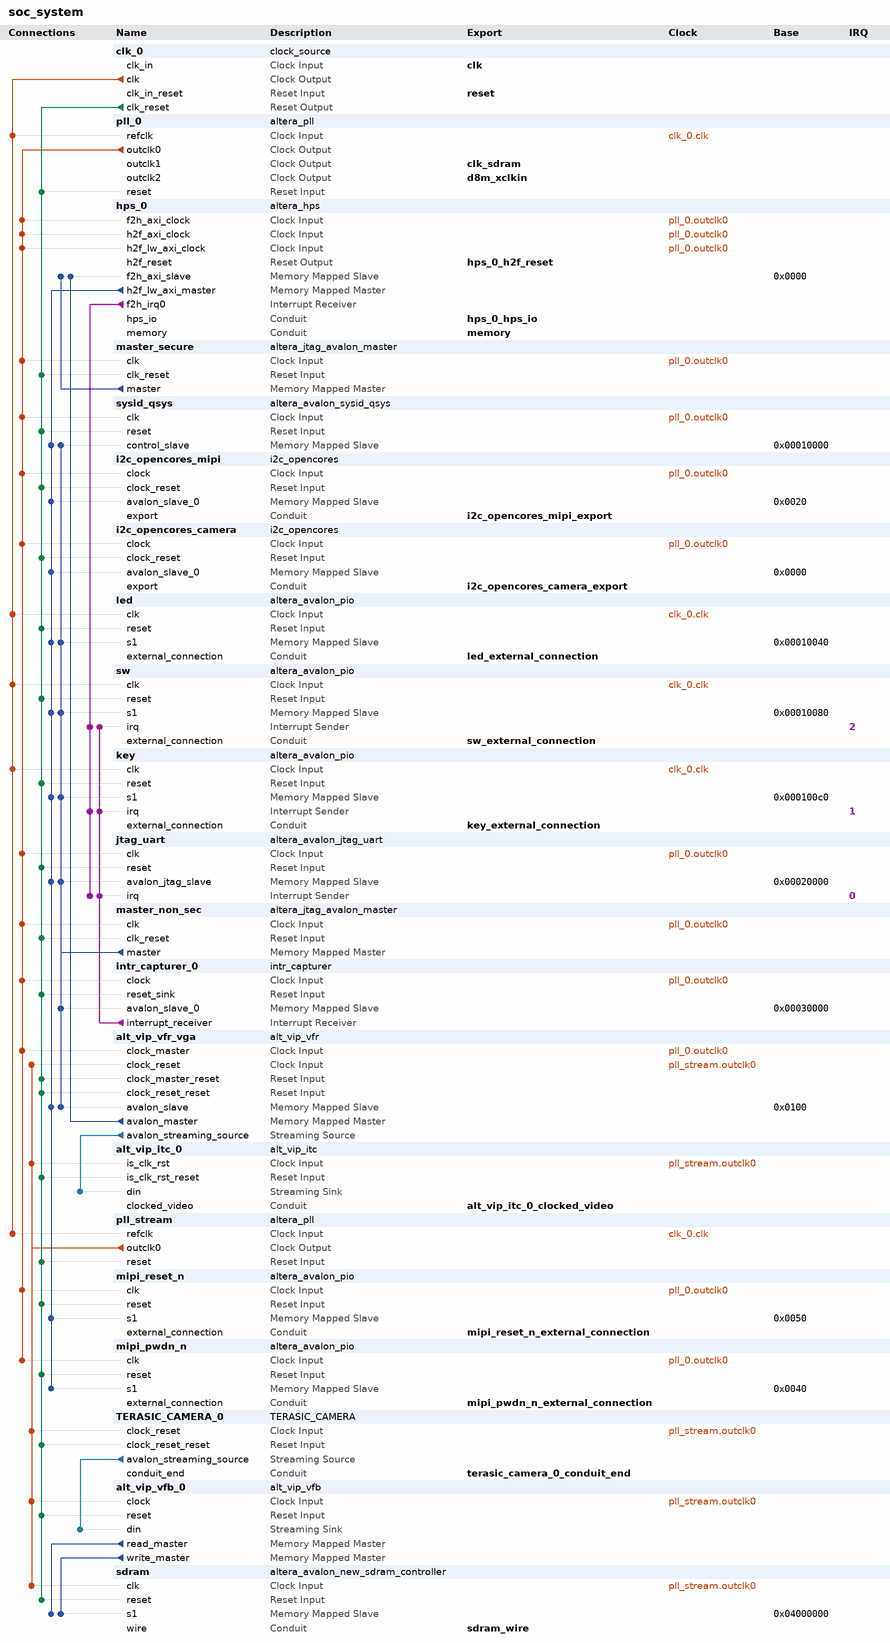
[diagram p0: system contents]
# Platform Designer (Qsys) system soc_system, Cyclone V 5CSEMA5F31C6
# Parameters at their usual value, and those the tool derives, are not listed.
package require -exact qsys 15.1
create_system soc_system
set_project_property DEVICE_FAMILY {Cyclone V}
set_project_property DEVICE 5CSEMA5F31C6

add_instance clk_0 clock_source 15.1
set_instance_parameter_value clk_0 clockFrequency 50000000

add_instance pll_0 altera_pll 15.1
set_instance_parameter_value pll_0 gui_device_speed_grade 1
set_instance_parameter_value pll_0 gui_number_of_clocks 3
set_instance_parameter_value pll_0 gui_operation_mode direct
set_instance_parameter_value pll_0 gui_output_clock_frequency0 100.0
set_instance_parameter_value pll_0 gui_output_clock_frequency1 100.0
set_instance_parameter_value pll_0 gui_output_clock_frequency2 20.0
set_instance_parameter_value pll_0 gui_phase_shift1 -4000
set_instance_parameter_value pll_0 gui_pll_mode {Integer-N PLL}
set_instance_parameter_value pll_0 gui_reference_clock_frequency 100.0
set_instance_parameter_value pll_0 gui_use_locked false

add_instance hps_0 altera_hps 15.1
set_instance_parameter_value hps_0 BOOTFROMFPGA_Enable true
set_instance_parameter_value hps_0 EMAC1_Mode RGMII
set_instance_parameter_value hps_0 EMAC1_PinMuxing {HPS I/O Set 0}
set_instance_parameter_value hps_0 F2SCLK_COLDRST_Enable false
set_instance_parameter_value hps_0 F2SCLK_DBGRST_Enable false
set_instance_parameter_value hps_0 F2SCLK_WARMRST_Enable false
set_instance_parameter_value hps_0 F2SINTERRUPT_Enable true
set_instance_parameter_value hps_0 F2S_Width 3
set_instance_parameter_value hps_0 FPGA_PERIPHERAL_OUTPUT_CLOCK_FREQ_EMAC0_GTX_CLK 100
set_instance_parameter_value hps_0 FPGA_PERIPHERAL_OUTPUT_CLOCK_FREQ_EMAC0_MD_CLK 100.0
set_instance_parameter_value hps_0 FPGA_PERIPHERAL_OUTPUT_CLOCK_FREQ_EMAC1_GTX_CLK 100
set_instance_parameter_value hps_0 FPGA_PERIPHERAL_OUTPUT_CLOCK_FREQ_EMAC1_MD_CLK 100.0
set_instance_parameter_value hps_0 HPS_PROTOCOL DDR3
set_instance_parameter_value hps_0 I2C0_Mode I2C
set_instance_parameter_value hps_0 I2C0_PinMuxing {HPS I/O Set 0}
set_instance_parameter_value hps_0 I2C1_Mode I2C
set_instance_parameter_value hps_0 I2C1_PinMuxing {HPS I/O Set 0}
set_instance_parameter_value hps_0 LWH2F_Enable true
set_instance_parameter_value hps_0 MEM_BANKADDR_WIDTH 3
set_instance_parameter_value hps_0 MEM_CLK_FREQ 400.0
set_instance_parameter_value hps_0 MEM_COL_ADDR_WIDTH 10
set_instance_parameter_value hps_0 MEM_DQ_WIDTH 32
set_instance_parameter_value hps_0 MEM_DRV_STR RZQ/7
set_instance_parameter_value hps_0 MEM_ROW_ADDR_WIDTH 15
set_instance_parameter_value hps_0 MEM_RTT_NOM RZQ/4
set_instance_parameter_value hps_0 MEM_RTT_WR RZQ/4
set_instance_parameter_value hps_0 MEM_TCL 11
set_instance_parameter_value hps_0 MEM_TFAW_NS 30.0
set_instance_parameter_value hps_0 MEM_TRAS_NS 35.0
set_instance_parameter_value hps_0 MEM_TRCD_NS 13.75
set_instance_parameter_value hps_0 MEM_TRFC_NS 260.0
set_instance_parameter_value hps_0 MEM_TRP_NS 13.75
set_instance_parameter_value hps_0 MEM_VENDOR JEDEC
set_instance_parameter_value hps_0 MEM_WTCL 8
set_instance_parameter_value hps_0 QSPI_Mode {1 SS}
set_instance_parameter_value hps_0 QSPI_PinMuxing {HPS I/O Set 0}
set_instance_parameter_value hps_0 REF_CLK_FREQ 25.0
set_instance_parameter_value hps_0 S2FCLK_USER2CLK 1
set_instance_parameter_value hps_0 S2F_Width 2
set_instance_parameter_value hps_0 SDIO_Mode {4-bit Data}
set_instance_parameter_value hps_0 SDIO_PinMuxing {HPS I/O Set 0}
set_instance_parameter_value hps_0 SPIM1_Mode {Single Slave Select}
set_instance_parameter_value hps_0 SPIM1_PinMuxing {HPS I/O Set 0}
set_instance_parameter_value hps_0 STM_Enable false
set_instance_parameter_value hps_0 TIMING_BOARD_AC_SKEW 0.03
set_instance_parameter_value hps_0 TIMING_BOARD_AC_TO_CK_SKEW 0.0
set_instance_parameter_value hps_0 TIMING_BOARD_DQ_TO_DQS_SKEW 0.0
set_instance_parameter_value hps_0 TIMING_BOARD_MAX_CK_DELAY 0.03
set_instance_parameter_value hps_0 TIMING_BOARD_MAX_DQS_DELAY 0.02
set_instance_parameter_value hps_0 TIMING_BOARD_SKEW_BETWEEN_DQS 0.08
set_instance_parameter_value hps_0 TIMING_BOARD_SKEW_CKDQS_DIMM_MAX 0.16
set_instance_parameter_value hps_0 TIMING_BOARD_SKEW_CKDQS_DIMM_MIN 0.09
set_instance_parameter_value hps_0 TIMING_BOARD_SKEW_WITHIN_DQS 0.01
set_instance_parameter_value hps_0 TIMING_TDH 65
set_instance_parameter_value hps_0 TIMING_TDQSCK 255
set_instance_parameter_value hps_0 TIMING_TDQSQ 125
set_instance_parameter_value hps_0 TIMING_TDS 30
set_instance_parameter_value hps_0 TIMING_TIH 140
set_instance_parameter_value hps_0 TIMING_TIS 180
set_instance_parameter_value hps_0 TIMING_TQSH 0.4
set_instance_parameter_value hps_0 UART0_Mode {No Flow Control}
set_instance_parameter_value hps_0 UART0_PinMuxing {HPS I/O Set 0}
set_instance_parameter_value hps_0 USB1_Mode SDR
set_instance_parameter_value hps_0 USB1_PinMuxing {HPS I/O Set 0}
set_instance_parameter_value hps_0 desired_cfg_clk_mhz 100.0
set_instance_parameter_value hps_0 desired_qspi_clk_mhz 400.0

add_instance master_secure altera_jtag_avalon_master 15.1

add_instance sysid_qsys altera_avalon_sysid_qsys 15.1
set_instance_parameter_value sysid_qsys id -1395322110

add_instance i2c_opencores_mipi i2c_opencores 12.0

add_instance i2c_opencores_camera i2c_opencores 12.0

add_instance led altera_avalon_pio 15.1
set_instance_parameter_value led direction Output
set_instance_parameter_value led width 10

add_instance sw altera_avalon_pio 15.1
set_instance_parameter_value sw bitClearingEdgeCapReg true
set_instance_parameter_value sw captureEdge true
set_instance_parameter_value sw direction Input
set_instance_parameter_value sw edgeType ANY
set_instance_parameter_value sw generateIRQ true
set_instance_parameter_value sw irqType EDGE
set_instance_parameter_value sw width 10

add_instance key altera_avalon_pio 15.1
set_instance_parameter_value key bitClearingEdgeCapReg true
set_instance_parameter_value key captureEdge true
set_instance_parameter_value key direction Input
set_instance_parameter_value key edgeType FALLING
set_instance_parameter_value key generateIRQ true
set_instance_parameter_value key irqType EDGE
set_instance_parameter_value key width 4

add_instance jtag_uart altera_avalon_jtag_uart 15.1
set_instance_parameter_value jtag_uart allowMultipleConnections true
set_instance_parameter_value jtag_uart simInteractiveOptions INTERACTIVE_ASCII_OUTPUT

add_instance master_non_sec altera_jtag_avalon_master 15.1

add_instance intr_capturer_0 intr_capturer 100.99.98.97

add_instance alt_vip_vfr_vga alt_vip_vfr 14.0
set_instance_parameter_value alt_vip_vfr_vga MAX_IMAGE_WIDTH 1024

add_instance alt_vip_itc_0 alt_vip_itc 14.0
set_instance_parameter_value alt_vip_itc_0 FIFO_DEPTH 1920
set_instance_parameter_value alt_vip_itc_0 H_ACTIVE_PIXELS 1024
set_instance_parameter_value alt_vip_itc_0 H_BACK_PORCH 160
set_instance_parameter_value alt_vip_itc_0 H_FRONT_PORCH 24
set_instance_parameter_value alt_vip_itc_0 H_SYNC_LENGTH 136
set_instance_parameter_value alt_vip_itc_0 NUMBER_OF_COLOUR_PLANES 4
set_instance_parameter_value alt_vip_itc_0 THRESHOLD 1919
set_instance_parameter_value alt_vip_itc_0 V_ACTIVE_LINES 768
set_instance_parameter_value alt_vip_itc_0 V_BACK_PORCH 29
set_instance_parameter_value alt_vip_itc_0 V_FRONT_PORCH 3
set_instance_parameter_value alt_vip_itc_0 V_SYNC_LENGTH 6

add_instance pll_stream altera_pll 15.1
set_instance_parameter_value pll_stream gui_device_speed_grade 2
set_instance_parameter_value pll_stream gui_number_of_clocks 1
set_instance_parameter_value pll_stream gui_operation_mode normal
set_instance_parameter_value pll_stream gui_output_clock_frequency0 130.0
set_instance_parameter_value pll_stream gui_pll_mode {Fractional-N PLL}
set_instance_parameter_value pll_stream gui_reference_clock_frequency 50.0
set_instance_parameter_value pll_stream gui_use_locked true

add_instance mipi_reset_n altera_avalon_pio 15.1
set_instance_parameter_value mipi_reset_n direction Output
set_instance_parameter_value mipi_reset_n width 1

add_instance mipi_pwdn_n altera_avalon_pio 15.1
set_instance_parameter_value mipi_pwdn_n direction Output
set_instance_parameter_value mipi_pwdn_n width 1

add_instance TERASIC_CAMERA_0 TERASIC_CAMERA 1.0

add_instance alt_vip_vfb_0 alt_vip_vfb 13.1

add_instance sdram altera_avalon_new_sdram_controller 15.1
set_instance_parameter_value sdram TAC 5.5
set_instance_parameter_value sdram TRCD 20.0
set_instance_parameter_value sdram TRP 20.0
set_instance_parameter_value sdram casLatency 3
set_instance_parameter_value sdram columnWidth 10
set_instance_parameter_value sdram dataWidth 16
set_instance_parameter_value sdram generateSimulationModel true
set_instance_parameter_value sdram model single_Micron_MT48LC4M32B2_7_chip
set_instance_parameter_value sdram numberOfBanks 4
set_instance_parameter_value sdram numberOfChipSelects 1
set_instance_parameter_value sdram powerUpDelay 100.0
set_instance_parameter_value sdram refreshPeriod 15.625
set_instance_parameter_value sdram rowWidth 13

# connections
add_connection clk_0.clk key.clk clock
add_connection clk_0.clk led.clk clock
add_connection clk_0.clk pll_0.refclk clock
add_connection clk_0.clk pll_stream.refclk clock
add_connection clk_0.clk sw.clk clock
add_connection pll_0.outclk0 alt_vip_vfr_vga.clock_master clock
add_connection pll_0.outclk0 hps_0.f2h_axi_clock clock
add_connection pll_0.outclk0 hps_0.h2f_axi_clock clock
add_connection pll_0.outclk0 hps_0.h2f_lw_axi_clock clock
add_connection pll_0.outclk0 i2c_opencores_camera.clock clock
add_connection pll_0.outclk0 i2c_opencores_mipi.clock clock
add_connection pll_0.outclk0 intr_capturer_0.clock clock
add_connection pll_0.outclk0 jtag_uart.clk clock
add_connection pll_0.outclk0 master_non_sec.clk clock
add_connection pll_0.outclk0 master_secure.clk clock
add_connection pll_0.outclk0 mipi_pwdn_n.clk clock
add_connection pll_0.outclk0 mipi_reset_n.clk clock
add_connection pll_0.outclk0 sysid_qsys.clk clock
add_connection pll_stream.outclk0 alt_vip_itc_0.is_clk_rst clock
add_connection pll_stream.outclk0 alt_vip_vfb_0.clock clock
add_connection pll_stream.outclk0 alt_vip_vfr_vga.clock_reset clock
add_connection pll_stream.outclk0 sdram.clk clock
add_connection pll_stream.outclk0 TERASIC_CAMERA_0.clock_reset clock
add_connection clk_0.clk_reset alt_vip_itc_0.is_clk_rst_reset reset
add_connection clk_0.clk_reset alt_vip_vfb_0.reset reset
add_connection clk_0.clk_reset alt_vip_vfr_vga.clock_master_reset reset
add_connection clk_0.clk_reset alt_vip_vfr_vga.clock_reset_reset reset
add_connection clk_0.clk_reset i2c_opencores_camera.clock_reset reset
add_connection clk_0.clk_reset i2c_opencores_mipi.clock_reset reset
add_connection clk_0.clk_reset intr_capturer_0.reset_sink reset
add_connection clk_0.clk_reset jtag_uart.reset reset
add_connection clk_0.clk_reset key.reset reset
add_connection clk_0.clk_reset led.reset reset
add_connection clk_0.clk_reset master_non_sec.clk_reset reset
add_connection clk_0.clk_reset master_secure.clk_reset reset
add_connection clk_0.clk_reset mipi_pwdn_n.reset reset
add_connection clk_0.clk_reset mipi_reset_n.reset reset
add_connection clk_0.clk_reset pll_0.reset reset
add_connection clk_0.clk_reset pll_stream.reset reset
add_connection clk_0.clk_reset sdram.reset reset
add_connection clk_0.clk_reset sw.reset reset
add_connection clk_0.clk_reset sysid_qsys.reset reset
add_connection clk_0.clk_reset TERASIC_CAMERA_0.clock_reset_reset reset
add_connection alt_vip_vfb_0.read_master sdram.s1 avalon
set_connection_parameter_value alt_vip_vfb_0.read_master/sdram.s1 baseAddress 0x04000000
add_connection alt_vip_vfb_0.write_master sdram.s1 avalon
set_connection_parameter_value alt_vip_vfb_0.write_master/sdram.s1 baseAddress 0x04000000
add_connection alt_vip_vfr_vga.avalon_master hps_0.f2h_axi_slave avalon
set_connection_parameter_value alt_vip_vfr_vga.avalon_master/hps_0.f2h_axi_slave baseAddress 0x0000
add_connection hps_0.h2f_lw_axi_master alt_vip_vfr_vga.avalon_slave avalon
set_connection_parameter_value hps_0.h2f_lw_axi_master/alt_vip_vfr_vga.avalon_slave baseAddress 0x0100
add_connection hps_0.h2f_lw_axi_master i2c_opencores_camera.avalon_slave_0 avalon
set_connection_parameter_value hps_0.h2f_lw_axi_master/i2c_opencores_camera.avalon_slave_0 baseAddress 0x0000
add_connection hps_0.h2f_lw_axi_master i2c_opencores_mipi.avalon_slave_0 avalon
set_connection_parameter_value hps_0.h2f_lw_axi_master/i2c_opencores_mipi.avalon_slave_0 baseAddress 0x0020
add_connection hps_0.h2f_lw_axi_master jtag_uart.avalon_jtag_slave avalon
set_connection_parameter_value hps_0.h2f_lw_axi_master/jtag_uart.avalon_jtag_slave baseAddress 0x00020000
add_connection hps_0.h2f_lw_axi_master key.s1 avalon
set_connection_parameter_value hps_0.h2f_lw_axi_master/key.s1 baseAddress 0x000100c0
add_connection hps_0.h2f_lw_axi_master led.s1 avalon
set_connection_parameter_value hps_0.h2f_lw_axi_master/led.s1 baseAddress 0x00010040
add_connection hps_0.h2f_lw_axi_master mipi_pwdn_n.s1 avalon
set_connection_parameter_value hps_0.h2f_lw_axi_master/mipi_pwdn_n.s1 baseAddress 0x0040
add_connection hps_0.h2f_lw_axi_master mipi_reset_n.s1 avalon
set_connection_parameter_value hps_0.h2f_lw_axi_master/mipi_reset_n.s1 baseAddress 0x0050
add_connection hps_0.h2f_lw_axi_master sw.s1 avalon
set_connection_parameter_value hps_0.h2f_lw_axi_master/sw.s1 baseAddress 0x00010080
add_connection hps_0.h2f_lw_axi_master sysid_qsys.control_slave avalon
set_connection_parameter_value hps_0.h2f_lw_axi_master/sysid_qsys.control_slave baseAddress 0x00010000
add_connection master_non_sec.master alt_vip_vfr_vga.avalon_slave avalon
set_connection_parameter_value master_non_sec.master/alt_vip_vfr_vga.avalon_slave baseAddress 0x0100
add_connection master_non_sec.master intr_capturer_0.avalon_slave_0 avalon
set_connection_parameter_value master_non_sec.master/intr_capturer_0.avalon_slave_0 baseAddress 0x00030000
add_connection master_non_sec.master jtag_uart.avalon_jtag_slave avalon
set_connection_parameter_value master_non_sec.master/jtag_uart.avalon_jtag_slave baseAddress 0x00020000
add_connection master_non_sec.master key.s1 avalon
set_connection_parameter_value master_non_sec.master/key.s1 baseAddress 0x000100c0
add_connection master_non_sec.master led.s1 avalon
set_connection_parameter_value master_non_sec.master/led.s1 baseAddress 0x00010040
add_connection master_non_sec.master sw.s1 avalon
set_connection_parameter_value master_non_sec.master/sw.s1 baseAddress 0x00010080
add_connection master_non_sec.master sysid_qsys.control_slave avalon
set_connection_parameter_value master_non_sec.master/sysid_qsys.control_slave baseAddress 0x00010000
add_connection master_secure.master hps_0.f2h_axi_slave avalon
set_connection_parameter_value master_secure.master/hps_0.f2h_axi_slave baseAddress 0x0000
add_connection alt_vip_vfr_vga.avalon_streaming_source alt_vip_itc_0.din avalon_streaming
add_connection TERASIC_CAMERA_0.avalon_streaming_source alt_vip_vfb_0.din avalon_streaming
add_connection hps_0.f2h_irq0 jtag_uart.irq interrupt
set_connection_parameter_value hps_0.f2h_irq0/jtag_uart.irq irqNumber 0
add_connection hps_0.f2h_irq0 key.irq interrupt
set_connection_parameter_value hps_0.f2h_irq0/key.irq irqNumber 1
add_connection hps_0.f2h_irq0 sw.irq interrupt
set_connection_parameter_value hps_0.f2h_irq0/sw.irq irqNumber 2
add_connection intr_capturer_0.interrupt_receiver jtag_uart.irq interrupt
set_connection_parameter_value intr_capturer_0.interrupt_receiver/jtag_uart.irq irqNumber 0
add_connection intr_capturer_0.interrupt_receiver key.irq interrupt
set_connection_parameter_value intr_capturer_0.interrupt_receiver/key.irq irqNumber 1
add_connection intr_capturer_0.interrupt_receiver sw.irq interrupt
set_connection_parameter_value intr_capturer_0.interrupt_receiver/sw.irq irqNumber 2

# exported interfaces
add_interface alt_vip_itc_0_clocked_video conduit end
set_interface_property alt_vip_itc_0_clocked_video EXPORT_OF alt_vip_itc_0.clocked_video
add_interface clk clock sink
set_interface_property clk EXPORT_OF clk_0.clk_in
add_interface clk_sdram clock source
set_interface_property clk_sdram EXPORT_OF pll_0.outclk1
add_interface d8m_xclkin clock source
set_interface_property d8m_xclkin EXPORT_OF pll_0.outclk2
add_interface hps_0_h2f_reset reset source
set_interface_property hps_0_h2f_reset EXPORT_OF hps_0.h2f_reset
add_interface hps_0_hps_io conduit end
set_interface_property hps_0_hps_io EXPORT_OF hps_0.hps_io
add_interface i2c_opencores_camera_export conduit end
set_interface_property i2c_opencores_camera_export EXPORT_OF i2c_opencores_camera.export
add_interface i2c_opencores_mipi_export conduit end
set_interface_property i2c_opencores_mipi_export EXPORT_OF i2c_opencores_mipi.export
add_interface key_external_connection conduit end
set_interface_property key_external_connection EXPORT_OF key.external_connection
add_interface led_external_connection conduit end
set_interface_property led_external_connection EXPORT_OF led.external_connection
add_interface memory conduit end
set_interface_property memory EXPORT_OF hps_0.memory
add_interface mipi_pwdn_n_external_connection conduit end
set_interface_property mipi_pwdn_n_external_connection EXPORT_OF mipi_pwdn_n.external_connection
add_interface mipi_reset_n_external_connection conduit end
set_interface_property mipi_reset_n_external_connection EXPORT_OF mipi_reset_n.external_connection
add_interface reset reset sink
set_interface_property reset EXPORT_OF clk_0.clk_in_reset
add_interface sdram_wire conduit end
set_interface_property sdram_wire EXPORT_OF sdram.wire
add_interface sw_external_connection conduit end
set_interface_property sw_external_connection EXPORT_OF sw.external_connection
add_interface terasic_camera_0_conduit_end conduit end
set_interface_property terasic_camera_0_conduit_end EXPORT_OF TERASIC_CAMERA_0.conduit_end

set_interconnect_requirement {$system} qsys_mm.clockCrossingAdapter HANDSHAKE
set_interconnect_requirement {$system} qsys_mm.maxAdditionalLatency 1

save_system soc_system.qsys
